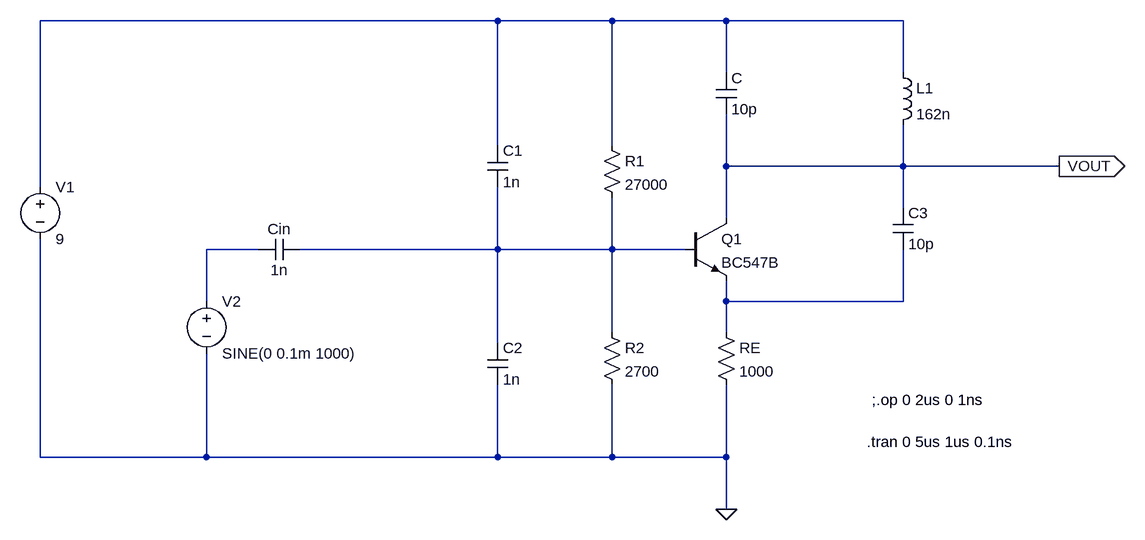
[diagram p0: schematic LC_Oszillator.asc]
LC_Oszillator.asc, the LTspice schematic file:
Version 4
SHEET 1 880 680
WIRE -112 -192 -816 -192
WIRE 64 -192 -112 -192
WIRE 240 -192 64 -192
WIRE 512 -192 240 -192
WIRE 240 -112 240 -192
WIRE 512 -112 512 -192
WIRE -112 0 -112 -192
WIRE 64 0 64 -192
WIRE 240 32 240 -48
WIRE 512 32 512 -32
WIRE 512 32 240 32
WIRE 752 32 512 32
WIRE -816 64 -816 -192
WIRE 512 96 512 32
WIRE 240 112 240 32
WIRE -480 160 -560 160
WIRE -112 160 -112 64
WIRE -112 160 -416 160
WIRE 64 160 64 80
WIRE 64 160 -112 160
WIRE 176 160 64 160
WIRE -560 240 -560 160
WIRE 240 240 240 208
WIRE 512 240 512 160
WIRE 512 240 240 240
WIRE 64 288 64 160
WIRE 240 288 240 240
WIRE -112 304 -112 160
WIRE -816 480 -816 144
WIRE -560 480 -560 320
WIRE -560 480 -816 480
WIRE -112 480 -112 368
WIRE -112 480 -560 480
WIRE 64 480 64 368
WIRE 64 480 -112 480
WIRE 240 480 240 368
WIRE 240 480 64 480
WIRE 240 560 240 480
FLAG 752 32 VOUT
IOPIN 752 32 Out
FLAG 240 560 0
SYMBOL npn 176 112 R0
SYMATTR InstName Q1
SYMATTR Value BC547B
SYMBOL cap -128 0 R0
SYMATTR InstName C1
SYMATTR Value 1n
SYMBOL cap -128 304 R0
SYMATTR InstName C2
SYMATTR Value 1n
SYMBOL cap 224 -112 R0
SYMATTR InstName C
SYMATTR Value 10p
SYMBOL cap 496 96 R0
SYMATTR InstName C3
SYMATTR Value 10p
SYMBOL cap -416 144 R90
WINDOW 0 0 32 VBottom 2
WINDOW 3 32 32 VTop 2
SYMATTR InstName Cin
SYMATTR Value 1n
SYMBOL res 48 -16 R0
SYMATTR InstName R1
SYMATTR Value 27000
SYMBOL res 48 272 R0
SYMATTR InstName R2
SYMATTR Value 2700
SYMBOL res 224 272 R0
SYMATTR InstName RE
SYMATTR Value 1000
SYMBOL ind 496 -128 R0
SYMATTR InstName L1
SYMATTR Value 162n
SYMBOL voltage -816 48 R0
WINDOW 123 0 0 Left 0
WINDOW 39 0 0 Left 0
SYMATTR InstName V1
SYMATTR Value 9
SYMBOL voltage -560 224 R0
WINDOW 123 0 0 Left 0
WINDOW 39 0 0 Left 0
SYMATTR InstName V2
SYMATTR Value SINE(0 0.1m 1000)
TEXT 456 456 Left 2 !.tran 0 5us 1us 0.1ns
TEXT 464 392 Left 2 !;.op 0 2us 0 1ns

The netlist it stands for:
* LC_Oszillator.asc
Q1 VOUT N003 N004 0 BC547B
C1 N001 N003 1n
C2 N003 0 1n
C N001 VOUT 10p
C3 VOUT N004 10p
Cin N003 N002 1n
R1 N001 N003 27000
R2 N003 0 2700
RE N004 0 1000
L1 N001 VOUT 162n
V1 N001 0 9
V2 N002 0 SINE(0 0.1m 1000)
.model NPN NPN
.model PNP PNP
.lib standard.bjt
.tran 0 5us 1us 0.1ns
;.op 0 2us 0 1ns
.backanno
.end